# Altium project GenRF_R00.PrjPcb
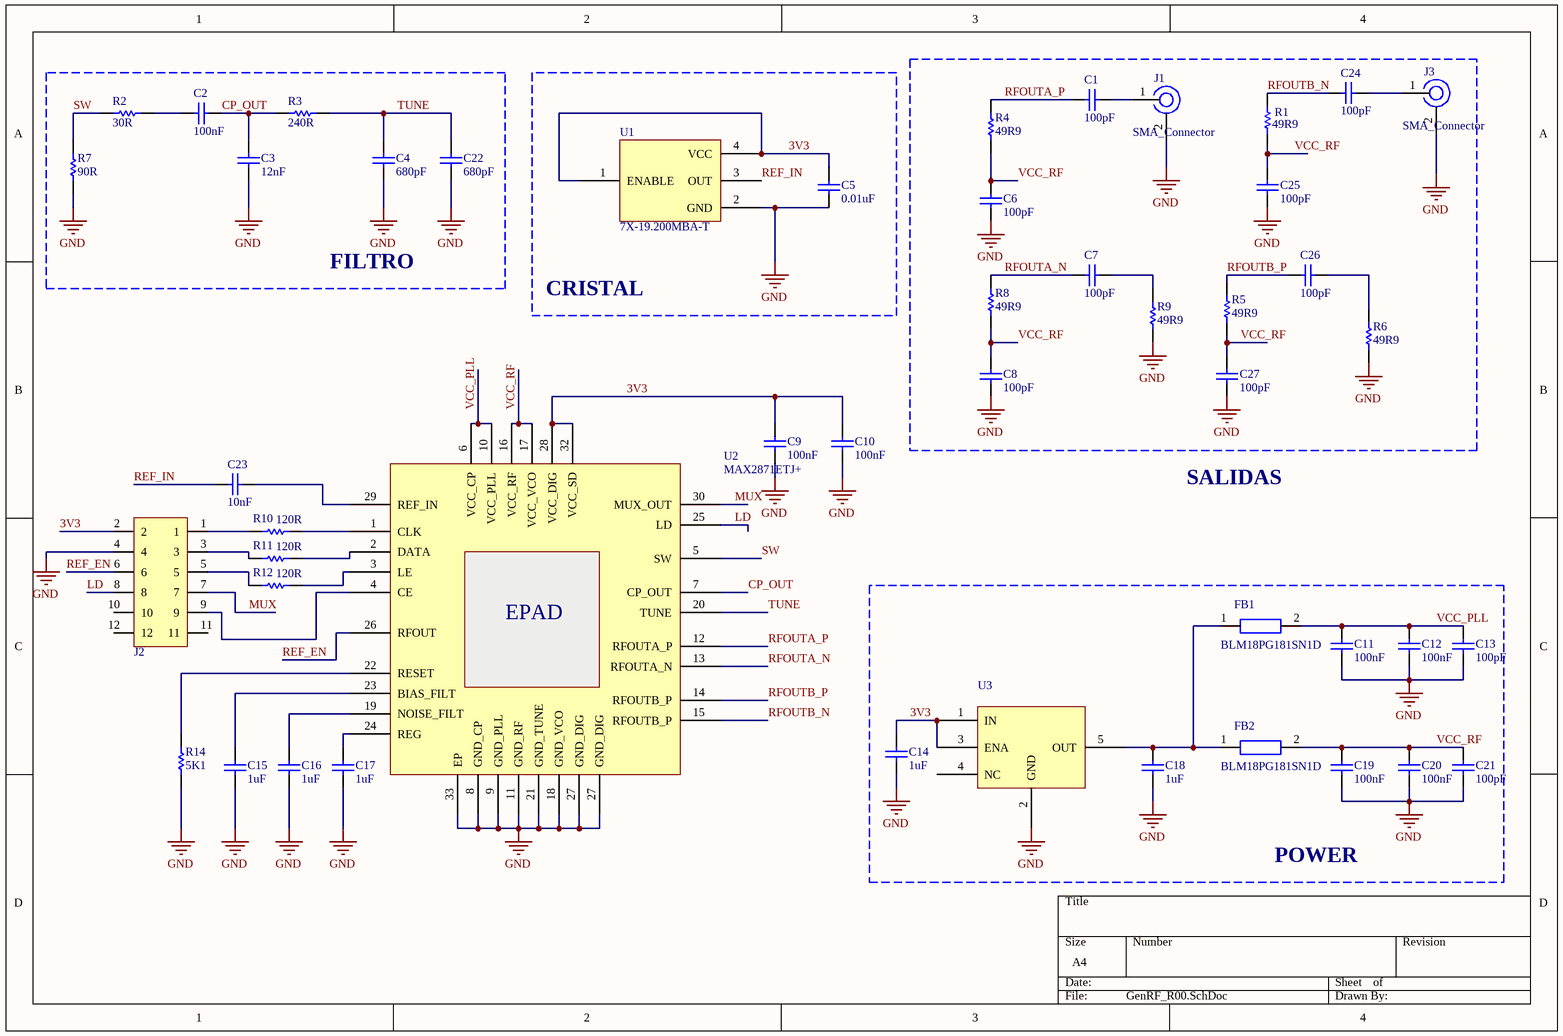
[diagram p0: GenRF_R00.SchDoc]
1 sheet, 48 parts. Net scope: global (net labels, ports and power ports of the same name join across sheets).
Board file: GenRF_R00.PcbDoc

## Sheet GenRF_R00.SchDoc
size A4; SheetNumber: 1; SheetTotal: 1

### Parts
C1  value 100pF  [C_0603]  (hidden comment: Capacitor)
C2  value 100nF  [C_0805]  (hidden comment: Capacitor)
C3  value 12nF  [C_0805]  (hidden comment: Capacitor)
C4  value 680pF  [C_0805]  (hidden comment: Capacitor)
C5  value 0.01uF  [C_0805]  (hidden comment: Capacitor)
C6  value 100pF  [C_0805]  (hidden comment: Capacitor)
C7  value 100pF  [C_0603]  (hidden comment: Capacitor)
C8  value 100pF  [C_0805]  (hidden comment: Capacitor)
C9  value 100nF  [C_0805]  (hidden comment: Capacitor)
C10  value 100nF  [C_0805]  (hidden comment: Capacitor)
C11  value 100nF  [C_0805]  (hidden comment: Capacitor)
C12  value 100nF  [C_0805]  (hidden comment: Capacitor)
C13  value 100pF  [C_0805]  (hidden comment: Capacitor)
C14  value 1uF  [C_0805]  (hidden comment: Capacitor)
C15  value 1uF  [C_0805]  (hidden comment: Capacitor)
C16  value 1uF  [C_0805]  (hidden comment: Capacitor)
C17  value 1uF  [C_0805]  (hidden comment: Capacitor)
C18  value 1uF  [C_0805]  (hidden comment: Capacitor)
C19  value 100nF  [C_0805]  (hidden comment: Capacitor)
C20  value 100nF  [C_0805]  (hidden comment: Capacitor)
C21  value 100pF  [C_0805]  (hidden comment: Capacitor)
C22  value 680pF  [C_0805]  (hidden comment: Capacitor)
C23  value 10nF  [C_0805]  (hidden comment: Capacitor)
C24  value 100pF  [C_0603]  (hidden comment: Capacitor)
C25  value 100pF  [C_0805]  (hidden comment: Capacitor)
C26  value 100pF  [C_0603]  (hidden comment: Capacitor)
C27  value 100pF  [C_0805]  (hidden comment: Capacitor)
FB1  BLM18PG181SN1D  [FB_0603]
FB2  BLM18PG181SN1D  [FB_0603]
J1  SMA_Connector  [SMA_Connector]
J2  Tira de pines de 12  [Header_M_2x6_0.1"]  (value not drawn)
J3  SMA_Connector  [SMA_Connector]
R1  value 49R9  [R_0603]  (hidden comment: Resistor)
R2  value 30R  [R_0805]  (hidden comment: Resistor)
R3  value 240R  [R_0805]  (hidden comment: Resistor)
R4  value 49R9  [R_0603]  (hidden comment: Resistor)
R5  value 49R9  [R_0603]  (hidden comment: Resistor)
R6  value 49R9  [R_0603]  (hidden comment: Resistor)
R7  value 90R  [R_0805]  (hidden comment: Resistor)
R8  value 49R9  [R_0603]  (hidden comment: Resistor)
R9  value 49R9  [R_0603]  (hidden comment: Resistor)
R10  value 120R  [R_0805]  (hidden comment: Resistor)
R11  value 120R  [R_0805]  (hidden comment: Resistor)
R12  value 120R  [R_0805]  (hidden comment: Resistor)
R14  value 5K1  [R_0805]  (hidden comment: Resistor)
U1  7X-19.200MBA-T  [XTAL]
U2  MAX2871ETJ+  [MAX2870ETJ+]
U3  LP5907QMFX-3.3  [TSOP]  (value not drawn)

### Blocks framed on the sheet
FILTRO: C2-C4 C22 R2 R3 R7
CRISTAL: C5 U1
POWER: C11-C14 C18-C21 FB1 FB2 U3

### Nets
GND: C3.1 C4.1 C5.2 C6.2 C8.2 C9.1 C10.1 C11.1 C12.1 C13.1 C14.1 C15.1 C16.1 C17.1 C18.1 C19.1 C20.1 C21.1 C22.1 C25.2 C27.2 J1.2 J2.4 J3.2 R6.2 R7.2 R9.2 R14.1 U1.2(GND) U2.8(GND_CP) U2.9(GND_PLL) U2.11(GND_RF) U2.18(GND_VCO) U2.21(GND_TUNE) U2.27(GND_DIG) U2.33(EP) U3.2(GND)
3V3: C5.1 C9.2 C10.2 C14.2 J2.2 U1.1(ENABLE) U1.4(VCC) U2.28(VCC_DIG) U2.32(VCC_SD) U3.1(IN) U3.3(ENA)
CP_OUT: C2.1 C3.2 R3.2 U2.7(CP_OUT)
LD: J2.8 U2.25(LD)
MUX: J2.7 U2.30(MUX_OUT)
REF_EN: J2.6 U2.26(RFOUT)
REF_IN: C23.2 U1.3(OUT)
RFOUTA_N: C7.1 R8.2 U2.13(RFOUTA_N)
RFOUTA_P: C1.1 R4.2 U2.12(RFOUTA_P)
RFOUTB_N: C24.1 R1.2 U2.15(RFOUTB_P)
RFOUTB_P: C26.1 R5.1 U2.14(RFOUTB_P)
SW: R2.1 R7.1 U2.5(SW)
TUNE: C4.2 C22.2 R3.1 U2.20(TUNE)
VCC_PLL: C11.2 C12.2 C13.2 FB1.2 U2.6(VCC_CP) U2.10(VCC_PLL)
VCC_RF: C6.1 C8.1 C19.2 C20.2 C21.2 C25.1 C27.1 FB2.2 R1.1 R4.1 R5.2 R8.1 U2.16(VCC_RF) U2.17(VCC_VCO)
NetC1_2: C1.2 J1.1
NetC2_2: C2.2 R2.2
NetC7_2: C7.2 R9.1
NetC15_2: C15.2 U2.23(BIAS_FILT)
NetC16_2: C16.2 U2.19(NOISE_FILT)
NetC17_2: C17.2 U2.24(REG)
NetC18_2: C18.2 FB1.1 FB2.1 U3.5(OUT)
NetC23_1: C23.1 U2.29(REF_IN)
NetC24_2: C24.2 J3.1
NetC26_2: C26.2 R6.1
NetJ2_1: J2.1 R10.1
NetJ2_3: J2.3 R11.1
NetJ2_5: J2.5 R12.1
NetJ2_9: J2.9 U2.4(CE)
NetR10_2: R10.2 U2.1(CLK)
NetR11_2: R11.2 U2.2(DATA)
NetR12_2: R12.2 U2.3(LE)
NetR14_2: R14.2 U2.22(RESET)

Not connected (* = marked no-connect by the designer): J2 10 11 12; U3 4(NC)

### Notes on the sheet
- SALIDAS
- (in symbol MAX2871ETJ+) EPAD

### Library data of the parts
C1-C27 = Capacitor: SimulationGenericComponent: True
FB1 FB2 = Ferrite Bead
J1 J3 = SMA_Connector: Connector SMA
J2 = Headpin 10
R1-R12 R14 = Resistor: TC1: 0; SimulationGenericComponent: True; TC2: 0
U1 = 7X-19.200MBA-T: XTAL OSC XO 19.2000MHZ CMOS SMD
U3 = LP5907QMFX-3.3: IC REG LINEAR 3.3V 250MA SOT23-5